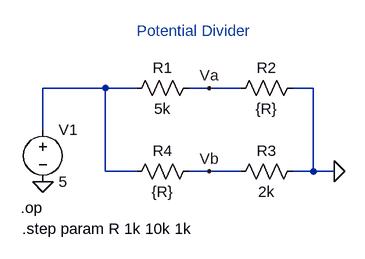
[diagram p0: schematic Potential_divider.asc]
Potential_divider.asc, the LTspice schematic file:
Version 4
SHEET 1 880 680
WIRE 48 128 -48 128
WIRE 96 128 48 128
WIRE 208 128 176 128
WIRE 256 128 208 128
WIRE 368 128 336 128
WIRE -48 192 -48 128
WIRE 48 256 48 128
WIRE 96 256 48 256
WIRE 208 256 176 256
WIRE 256 256 208 256
WIRE 368 256 368 128
WIRE 368 256 336 256
WIRE 400 256 368 256
FLAG -48 272 0
FLAG 400 256 0
FLAG 208 128 Va
FLAG 208 256 Vb
SYMBOL res 192 112 R90
WINDOW 0 0 56 VBottom 2
WINDOW 3 32 56 VTop 2
SYMATTR InstName R1
SYMATTR Value 5k
SYMBOL res 352 112 R90
WINDOW 0 0 56 VBottom 2
WINDOW 3 32 56 VTop 2
SYMATTR InstName R2
SYMATTR Value {R}
SYMBOL res 352 240 R90
WINDOW 0 0 56 VBottom 2
WINDOW 3 32 56 VTop 2
SYMATTR InstName R3
SYMATTR Value 2k
SYMBOL res 192 240 R90
WINDOW 0 0 56 VBottom 2
WINDOW 3 32 56 VTop 2
SYMATTR InstName R4
SYMATTR Value {R}
SYMBOL voltage -48 176 R0
SYMATTR InstName V1
SYMATTR Value 5
TEXT -82 312 Left 2 !.op
TEXT -80 344 Left 2 !.step param R 1k 10k 1k
TEXT 96 40 Left 2 ;Potential Divider

The netlist it stands for:
* Potential_divider.asc
R1 Va N001 5k
R2 0 Va {R}
R3 0 Vb 2k
R4 Vb N001 {R}
V1 N001 0 5
.op
.step param R 1k 10k 1k
* Potential Divider
.backanno
.end

* Results of the author's LTspice run, read from the files saved beside the schematic
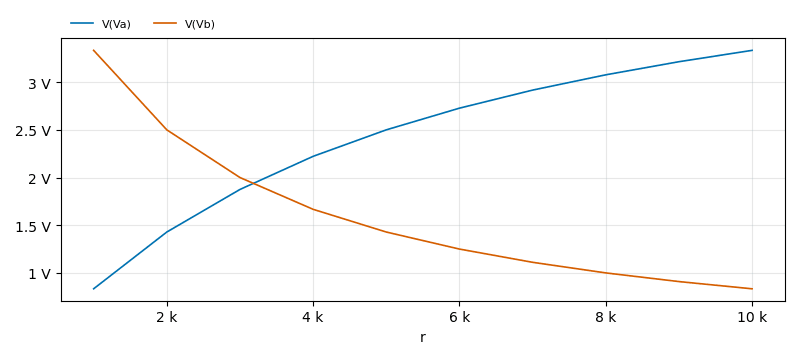
[diagram p1: Operating Point of Potential_divider.asc, plotted from the saved traces]
* Operating Point, 1 run:
*   V(Va): 833.3 mV at r=1 k, 3.333 V at r=10 k, min 833.3 mV, max 3.333 V
*   V(Vb): 3.333 V at r=1 k, 833.3 mV at r=10 k, min 833.3 mV, max 3.333 V